# Altium schematic sheet DC.SchDoc: param:Title (part 1 of 3)
size A4; Author: param.Autor; Version: param:Version
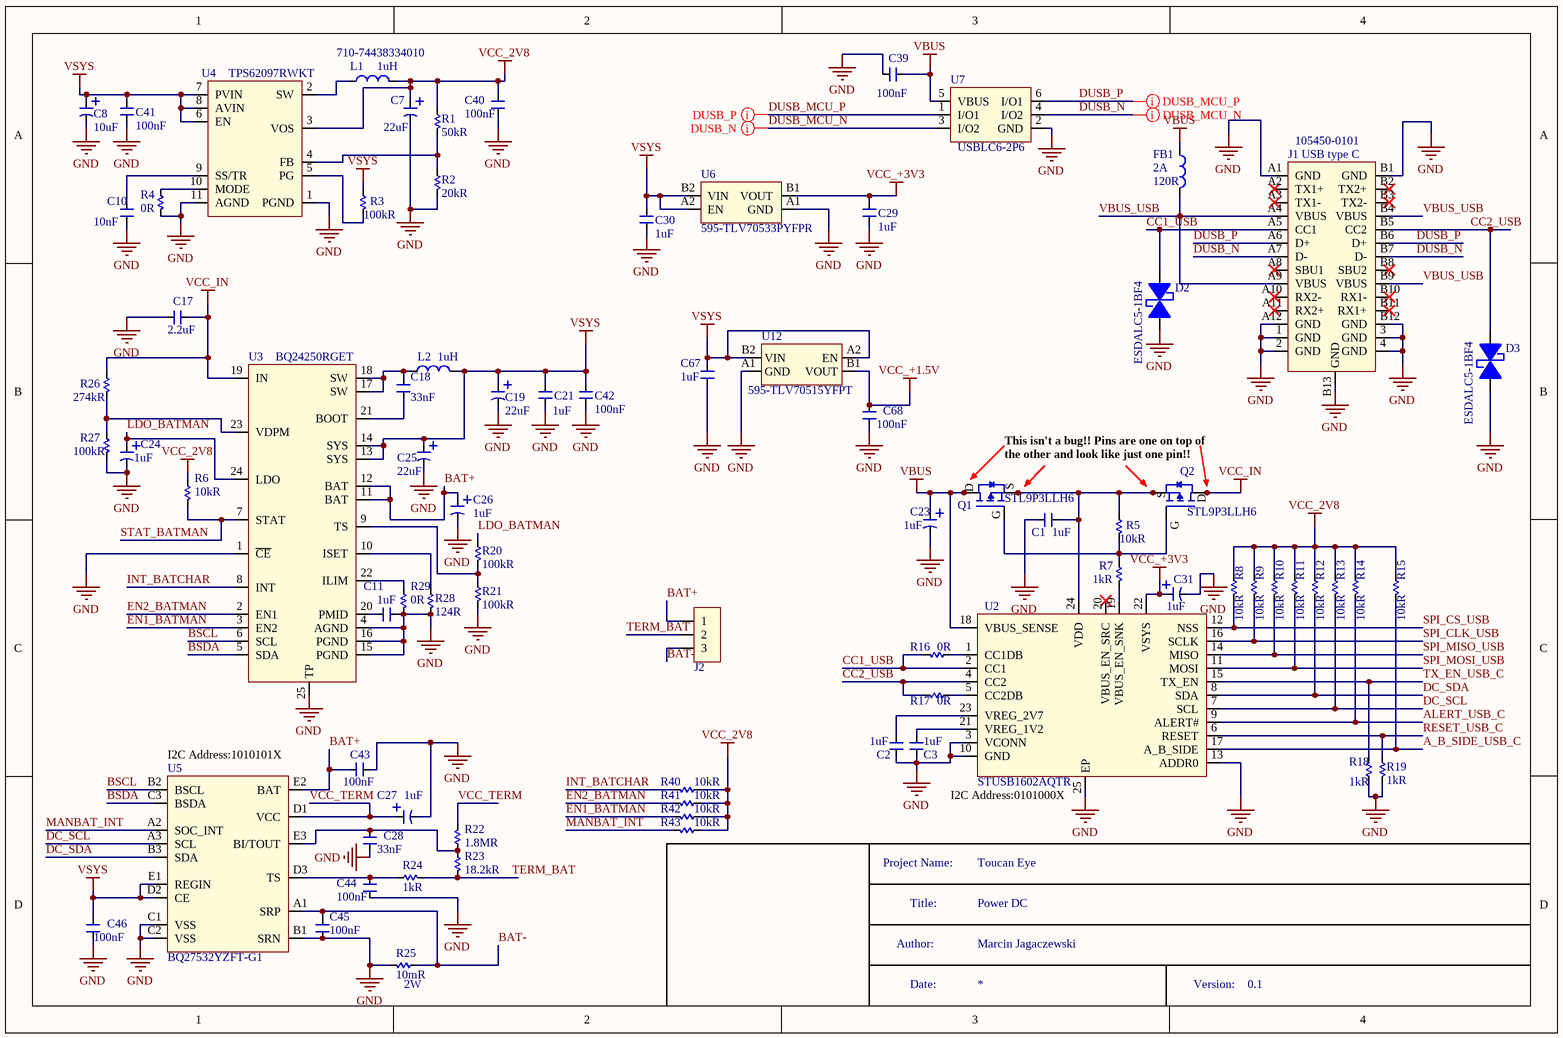
[diagram p0: DC.SchDoc]

## Parts
C1  Capacitance: 1uF  [C_0402]  (hidden comment: C0402_1uF_TMK105BJ105MV-F)
C2  Capacitance: 1uF  [C_0402]  (hidden comment: C0402_1uF_TMK105BJ105MV-F)
C3  Capacitance: 1uF  [C_0402]  (hidden comment: C0402_1uF_TMK105BJ105MV-F)
C7  Capacitance: 22uF  [C_3216]  (hidden comment: C_22u_TANTAL_A_T491A226K006AT)
C8  Capacitance: 10uF  [C_3216]  (hidden comment: C_10u_TANTAL_A_T491A106K010AT7280)
C10  Capacitance: 10nF  [C_0402]  (hidden comment: C0402_10n_C0402C103K4PACTU)
C11  Capacitance: 1uF  [C_0402]  (hidden comment: C0402_1uF_TMK105BJ105MV-F)
C17  Capacitance: 2.2uF  [C_0402]  (hidden comment: C0402_2.2u_GRT155R61E225KE13D)
C18  Capacitance: 33nF  [C_0402]  (hidden comment: C0402_33n_GCM155R71E333KA55D)
C19  Capacitance: 22uF  [C_3216]  (hidden comment: C_22u_TANTAL_A_T491A226K006AT)
C21  Capacitance: 1uF  [C_0402]  (hidden comment: C0402_1uF_TMK105BJ105MV-F)
C23  Capacitance: 1uF  [C_3216]  (hidden comment: C_1u_TANTAL_A_293D105X0025A2TE3)
C24  Capacitance: 1uF  [C_3216]  (hidden comment: C_1u_TANTAL_A_293D105X0025A2TE3)
C25  Capacitance: 22uF  [C_3216]  (hidden comment: C_22u_TANTAL_A_T491A226K006AT)
C26  Capacitance: 1uF  [C_3216]  (hidden comment: C_1u_TANTAL_A_293D105X0025A2TE3)
C27  Capacitance: 1uF  [C_3216]  (hidden comment: C_1u_TANTAL_A_293D105X0025A2TE3)
C28  Capacitance: 33nF  [C_0402]  (hidden comment: C0402_33n_GCM155R71E333KA55D)
C29  Capacitance: 1uF  [C_0402]  (hidden comment: C0402_1uF_TMK105BJ105MV-F)
C30  Capacitance: 1uF  [C_0402]  (hidden comment: C0402_1uF_TMK105BJ105MV-F)
C31  Capacitance: 1uF  [C_3216]  (hidden comment: C_1u_TANTAL_A_293D105X0025A2TE3)
C39  Capacitance: 100nF  [C_0201]  (hidden comment: C0201_100n_GRM033R6YA104KE14D)
C40  Capacitance: 100nF  [C_0201]  (hidden comment: C0201_100n_GRM033R6YA104KE14D)
C41  Capacitance: 100nF  [C_0201]  (hidden comment: C0201_100n_GRM033R6YA104KE14D)
C42  Capacitance: 100nF  [C_0201]  (hidden comment: C0201_100n_GRM033R6YA104KE14D)
C43  Capacitance: 100nF  [C_0201]  (hidden comment: C0201_100n_GRM033R6YA104KE14D)
C44  Capacitance: 100nF  [C_0201]  (hidden comment: C0201_100n_GRM033R6YA104KE14D)
C45  Capacitance: 100nF  [C_0201]  (hidden comment: C0201_100n_GRM033R6YA104KE14D)
C46  Capacitance: 100nF  [C_0201]  (hidden comment: C0201_100n_GRM033R6YA104KE14D)
C67  Capacitance: 1uF  [C_0402]  (hidden comment: C0402_1uF_TMK105BJ105MV-F)
C68  Capacitance: 100nF  [C_0201]  (hidden comment: C0201_100n_GRM033R6YA104KE14D)
D2  ESDALC5-1BF4  [DFN35P60X32-2N]
D3  ESDALC5-1BF4  [DFN35P60X32-2N]
FB1  DC Current: 2A  Impedance: 120R  [L_0603]  (hidden comment: BLM18PG-121SN1D)
J1  105450-0101  Connector Type: USB type C  [USB TYPE C (MOLEX)]
J2  Goldpin 3x1.27mm NDI  [HEADER 3x1.27mm]  (value not drawn)  (net tie, no BOM)
L1  Inductance: 1uH  Supplier Part Number 1: 710-74438334010  [L_3x3]  (hidden comment: L_1u_3x3_74438334010)
L2  Inductance: 1uH  [L_3x3]  (hidden comment: l_1U_3X3_74438336010)
Q1  STL9P3LLH6  [PowerFLAT]
Q2  STL9P3LLH6  [PowerFLAT]
R1  Resistance: 50kR  [R_0402]  (hidden comment: R0402_50k_CRCW040250K0FKED)
R2  Resistance: 20kR  [R_0402]  (hidden comment: R0402_20k_ERJ-2RKF2002X)
R3  Resistance: 100kR  [R_0402]  (hidden comment: R0402_100k_ERJ-2RKF1003X)
R4  Resistance: 0R  [R_0402]  (hidden comment: R0402_0ohm_RC0402FR-070RL)
R5  Resistance: 10kR  [R_0201]  (hidden comment: R0201_10k_ERJ-1GNF1002C)
R6  Resistance: 10kR  [R_0201]  (hidden comment: R0201_10k_ERJ-1GNF1002C)
R7  Resistance: 1kR  [R_0201]  (hidden comment: R0201_1k_ERJ-1GNF1001C)
R8  Resistance: 10kR  [R_0201]  (hidden comment: R0201_10k_ERJ-1GNF1002C)
R9  Resistance: 10kR  [R_0201]  (hidden comment: R0201_10k_ERJ-1GNF1002C)
R10  Resistance: 10kR  [R_0201]  (hidden comment: R0201_10k_ERJ-1GNF1002C)
R11  Resistance: 10kR  [R_0201]  (hidden comment: R0201_10k_ERJ-1GNF1002C)
R12  Resistance: 10kR  [R_0201]  (hidden comment: R0201_10k_ERJ-1GNF1002C)
R13  Resistance: 10kR  [R_0201]  (hidden comment: R0201_10k_ERJ-1GNF1002C)
R14  Resistance: 10kR  [R_0201]  (hidden comment: R0201_10k_ERJ-1GNF1002C)
R15  Resistance: 10kR  [R_0201]  (hidden comment: R0201_10k_ERJ-1GNF1002C)
R16  Resistance: 0R  [R_0201]  (hidden comment: R0201_0_ERJ-1GN0R00C)
R17  Resistance: 0R  [R_0201]  (hidden comment: R0201_0_ERJ-1GN0R00C)
R18  Resistance: 1kR  [R_0201]  (hidden comment: R0201_1k_ERJ-1GNF1001C)
R19  Resistance: 1kR  [R_0201]  (hidden comment: R0201_1k_ERJ-1GNF1001C)
R20  Resistance: 100kR  [R_0402]  (hidden comment: R0402_100k_ERJ-2RKF1003X)
R21  Resistance: 100kR  [R_0402]  (hidden comment: R0402_100k_ERJ-2RKF1003X)
R22  Resistance: 1.8MR  [R_0402]  (hidden comment: R0402_1.8Mohm_ERJ-2GEJ185X)
R23  Resistance: 18.2kR  [R_0402]  (hidden comment: R0402_18.2k_ERJ-2RKF1822X)
R24  Resistance: 1kR  [R_0201]  (hidden comment: R0201_1k_ERJ-1GNF1001C)
R25  Power Rating: 2W  Resistance: 10mR  [R2512]  (hidden comment: R2512_10m_WW25RR010FTL)
R26  Resistance: 274kR  [R_0402]  (hidden comment: R0402_274k_ERJ-2RKF2743X)
R27  Resistance: 100kR  [R_0402]  (hidden comment: R0402_100k_ERJ-2RKF1003X)
R28  Resistance: 124R  [R_0402]  (hidden comment: R0402_124OHM_ERJ-2RKF1240X)
R29  Resistance: 0R  [R_0402]  (hidden comment: R0402_0ohm_RC0402FR-070RL)
R40  Resistance: 10kR  [R_0201]  (hidden comment: R0201_10k_ERJ-1GNF1002C)
R41  Resistance: 10kR  [R_0201]  (hidden comment: R0201_10k_ERJ-1GNF1002C)
R42  Resistance: 10kR  [R_0201]  (hidden comment: R0201_10k_ERJ-1GNF1002C)
R43  Resistance: 10kR  [R_0201]  (hidden comment: R0201_10k_ERJ-1GNF1002C)
U2  STUSB1602AQTR  [QFN24]
U3  BQ24250RGET  [VQFN]
U4  TPS62097RWKT  [VQFN_11]
U5  BQ27532YZFT-G1  [DSBGA-15_PINS]
U6  Supplier Part Number 1: 595-TLV70533PYFPR  [DSBGA]  (hidden comment: TLV70533PYFPR)
U7  USBLC6-2P6  [SOT-666]
U12  Supplier Part Number 1: 595-TLV70515YFPT  [DSBGA]  (hidden comment: TLV70515YFPT)

## Nets
GND: C1.1 C2.1 C3.1 C7.2 C8.2 C10.1 C11.2 C17.2 C19.2 C21.1 C23.2 C24.2 C25.2 C26.2 C27.2 C28.1 C29.1 C30.2 C31.2 C39.1 C40.1 C41.2 C42.1 C43.1 C44.1 C45.2 C46.1 C67.1 C68.1 D2.1 D3.1 J1.1(GND) J1.2(GND) J1.3(GND) J1.4(GND) J1.A1(GND) J1.A12(GND) J1.B1(GND) J1.B12(GND) J1.B13(GND) R2.1 R4.1 R18.2 R19.1 R21.1 R25.1 R27.1 R28.1 R29.1 U2.3(VCONN) U2.10(GND) U2.13(ADDR0) U2.25(EP) U3.1(~{CE}) U3.4(AGND) U3.15(PGND) U3.16(PGND) U3.25(TP) U4.1(PGND) U4.11(AGND) U5.B1(SRN) U5.C1(VSS) U5.C2(VSS) U6.A1(GND) U7.2(GND) U12.A1(GND)
VBUS: C23.1 C39.2 FB1.1(Vcc) Q1.5(D) Q1.6(D) Q1.7(D) Q1.8(D) U2.18(VBUS_SENSE) U7.5(VBUS)
VCC_2V8: C7.1 C40.2 L1.2(Vcc) R1.2 R6.2 R8.2 R9.2 R10.2 R11.2 R12.2 R13.2 R14.2 R15.2 R40.2 R41.2 R42.2 R43.2 U4.3(VOS)
VCC_+1.5V: C68.2 U12.B1(VOUT)
VCC_+3V3: C29.2 C31.1 U2.22(VSYS) U6.B1(VOUT)
VCC_IN: C17.1 Q2.5(D) Q2.6(D) Q2.7(D) Q2.8(D) R26.2 U3.19(IN)
VSYS: C8.1 C19.1 C21.2 C25.1 C30.1 C41.1 C42.2 C46.2 C67.2 L2.2(Vcc) R3.2 U3.13(SYS) U3.14(SYS) U4.6(EN) U4.7(PVIN) U4.8(AVIN) U5.D2(CE) U5.E1(REGIN) U6.A2(EN) U6.B2(VIN) U12.A2(EN) U12.B2(VIN)
A_B_SIDE_USB_C: R15.1 U2.17(A_B_SIDE)
ALERT_USB_C: R14.1 U2.9(ALERT#)
BAT+: C26.1 C43.2 J2.1 U3.11(BAT) U3.12(BAT) U5.E2(BAT)
BAT-: C45.1 J2.3 R25.2 U5.A1(SRP)
BSCL: U3.6(SCL) U5.B2(BSCL)
BSDA: U3.5(SDA) U5.C3(BSDA)
CC1_USB: D2.2 J1.A5(CC1) R16.1 U2.2(CC1)
CC2_USB: D3.2 J1.B5(CC2) R17.1 U2.4(CC2)
DC_SCL: R13.1 U2.7(SCL) U5.A3(SCL)
DC_SDA: R12.1 U2.8(SDA) U5.B3(SDA)
DUSB_MCU_N: U7.3(I/O2)
DUSB_MCU_P: U7.1(I/O1)
DUSB_N: J1.A7(D-) J1.B7(D-) U7.4(I/O2)
DUSB_P: J1.A6(D+) J1.B6(D+) U7.6(I/O1)
EN1_BATMAN: R42.1 U3.3(EN2)
EN2_BATMAN: R41.1 U3.2(EN1)
INT_BATCHAR: R40.1 U3.8(INT)
LDO_BATMAN: C24.1 R20.2 U3.24(LDO)
MANBAT_INT: R43.1 U5.A2(SOC_INT)
RESET_USB_C: R19.2 U2.6(RESET)
SPI_CLK_USB: R9.1 U2.16(SCLK)
SPI_CS_USB: R8.1 U2.12(NSS)
SPI_MISO_USB: R10.1 U2.14(MISO)
SPI_MOSI_USB: R11.1 U2.11(MOSI)
STAT_BATMAN: R6.1 U3.7(STAT)
TERM_BAT: J2.2 R23.1 R24.1
TX_EN_USB_C: R18.1 U2.15(TX_EN)
VBUS_USB: FB1.2(Vcc) J1.A4(VBUS) J1.A9(VBUS) J1.B4(VBUS) J1.B9(VBUS)
VCC_TERM: C27.1 R22.1 U5.D1(VCC)
NetC1_2: C1.2 Q1.1(S) Q1.2(S) Q1.3(S) Q2.1(S) Q2.2(S) Q2.3(S) R5.2 U2.24(VDD)
NetC2_2: C2.2 U2.23(VREG_2V7)
NetC3_2: C3.2 U2.21(VREG_1V2)
NetC10_2: C10.2 U4.9(SS/TR)
NetC11_1: C11.1 U3.20(PMID)
NetC18_1: C18.1 U3.21(BOOT)
NetC18_2: C18.2 L2.1(Vcc) U3.17(SW) U3.18(SW)
NetC28_2: C28.2 R22.2 R23.2 U5.E3(BI/TOUT)
NetC44_2: C44.2 R24.2 U5.D3(TS)
NetL1_1: L1.1(Vcc) U4.2(SW)
NetQ1_4: Q1.4(G) Q2.4(G) R5.1 R7.2
NetR1_1: R1.1 R2.2 U4.4(FB)
NetR3_1: R3.1 U4.5(PG)
NetR4_2: R4.2 U4.10(MODE)
NetR7_1: R7.1 U2.19(VBUS_EN_SNK)
NetR16_2: R16.2 U2.1(CC1DB)
NetR17_2: R17.2 U2.5(CC2DB)
NetR20_1: R20.1 R21.2 U3.9(TS)
NetR26_1: R26.1 R27.2 U3.23(VDPM)
NetR28_2: R28.2 U3.10(ISET)
NetR29_2: R29.2 U3.22(ILIM)

Not connected (* = marked no-connect by the designer): J1 A2(TX1+)* A3(TX1-)* A8(SBU1)* A10(RX2-)* A11(RX2+)* B2(TX2+)* B3(TX2-)* B8(SBU2)* B10(RX1-)* B11(RX1+)*; U2 20(VBUS_EN_SRC)*

## Layout directives
differential pair: DUSB_MCU_N, DUSB_MCU_P, DUSB_N, DUSB_P

## Notes on the sheet
- This isn't a bug!! Pins are one on top of the other and look like just one pin!!
- (near U5) I2C Address:1010101X
- (near U2) I2C Address:0101000X
- Project Name:
- Title:
- Power DC
- Toucan Eye
- Author:
- Date:
- Marcin Jagaczewski
- Version:
- 0.1